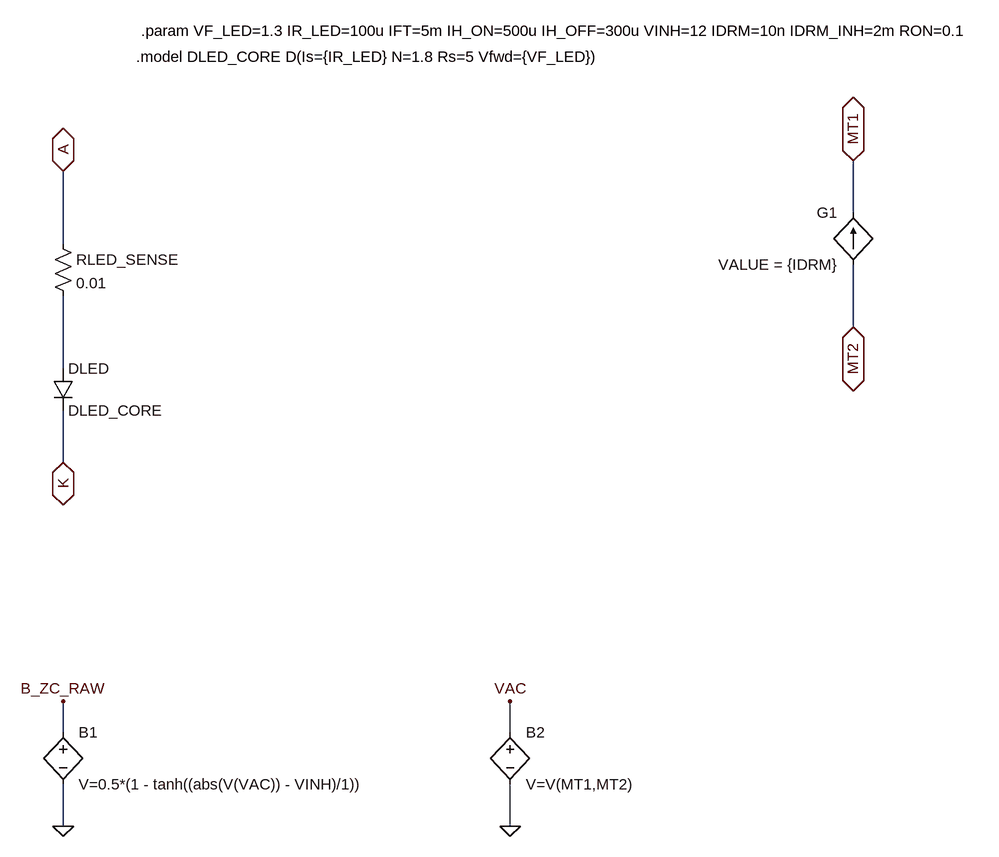
[diagram p0: schematic MOC3083_MODEL.asc]
MOC3083_MODEL.asc, the LTspice schematic file:
Version 4.1
SHEET 1 1640 1204
WIRE 1344 240 1344 160
WIRE 128 288 128 176
WIRE 1344 416 1344 320
WIRE 128 480 128 368
WIRE 128 624 128 544
WIRE 128 1040 128 992
WIRE 816 1040 816 992
WIRE 128 1184 128 1120
WIRE 816 1184 816 1120
FLAG 128 176 A
IOPIN 128 176 BiDir
FLAG 128 624 K
IOPIN 128 624 BiDir
FLAG 1344 416 MT2
IOPIN 1344 416 BiDir
FLAG 1344 160 MT1
IOPIN 1344 160 BiDir
FLAG 128 1184 0
FLAG 128 992 B_ZC_RAW
FLAG 816 1184 0
FLAG 816 992 VAC
SYMBOL diode 112 480 R0
SYMATTR InstName DLED
SYMATTR Value DLED_CORE
SYMBOL f 1344 320 R180
WINDOW 0 24 80 Left 2
WINDOW 3 24 0 Left 2
SYMATTR InstName G1
SYMATTR Value VALUE = {IDRM}
SYMATTR Prefix G
SYMBOL bv 128 1024 R0
SYMATTR InstName B1
SYMATTR Value V=0.5*(1 - tanh((abs(V(VAC)) - VINH)/1))
SYMBOL res 112 272 R0
SYMATTR InstName RLED_SENSE
SYMATTR Value 0.01
SYMBOL bv 816 1024 R0
SYMATTR InstName B2
SYMATTR Value V=V(MT1,MT2)
TEXT 248 -40 Left 2 !.param VF_LED=1.3 IR_LED=100u IFT=5m IH_ON=500u IH_OFF=300u VINH=12 IDRM=10n IDRM_INH=2m RON=0.1
TEXT 240 0 Left 2 !.model DLED_CORE D(Is={IR_LED} N=1.8 Rs=5 Vfwd={VF_LED})

The netlist it stands for:
* MOC3083_MODEL.asc
DLED N001 K DLED_CORE
G1 MT2 MT1 VALUE = {IDRM}
B1 B_ZC_RAW 0 V=0.5*(1 - tanh((abs(V(VAC)) - VINH)/1))
RLED_SENSE A N001 0.01
B2 VAC 0 V=V(MT1,MT2)
.model D D
.lib standard.dio
.param VF_LED=1.3 IR_LED=100u IFT=5m IH_ON=500u IH_OFF=300u VINH=12 IDRM=10n IDRM_INH=2m RON=0.1
.model DLED_CORE D(Is={IR_LED} N=1.8 Rs=5 Vfwd={VF_LED})
.backanno
.end